# Altium schematic sheet Power_distribution2.SchDoc
size A4; SheetNumber: 2; SheetTotal: 2
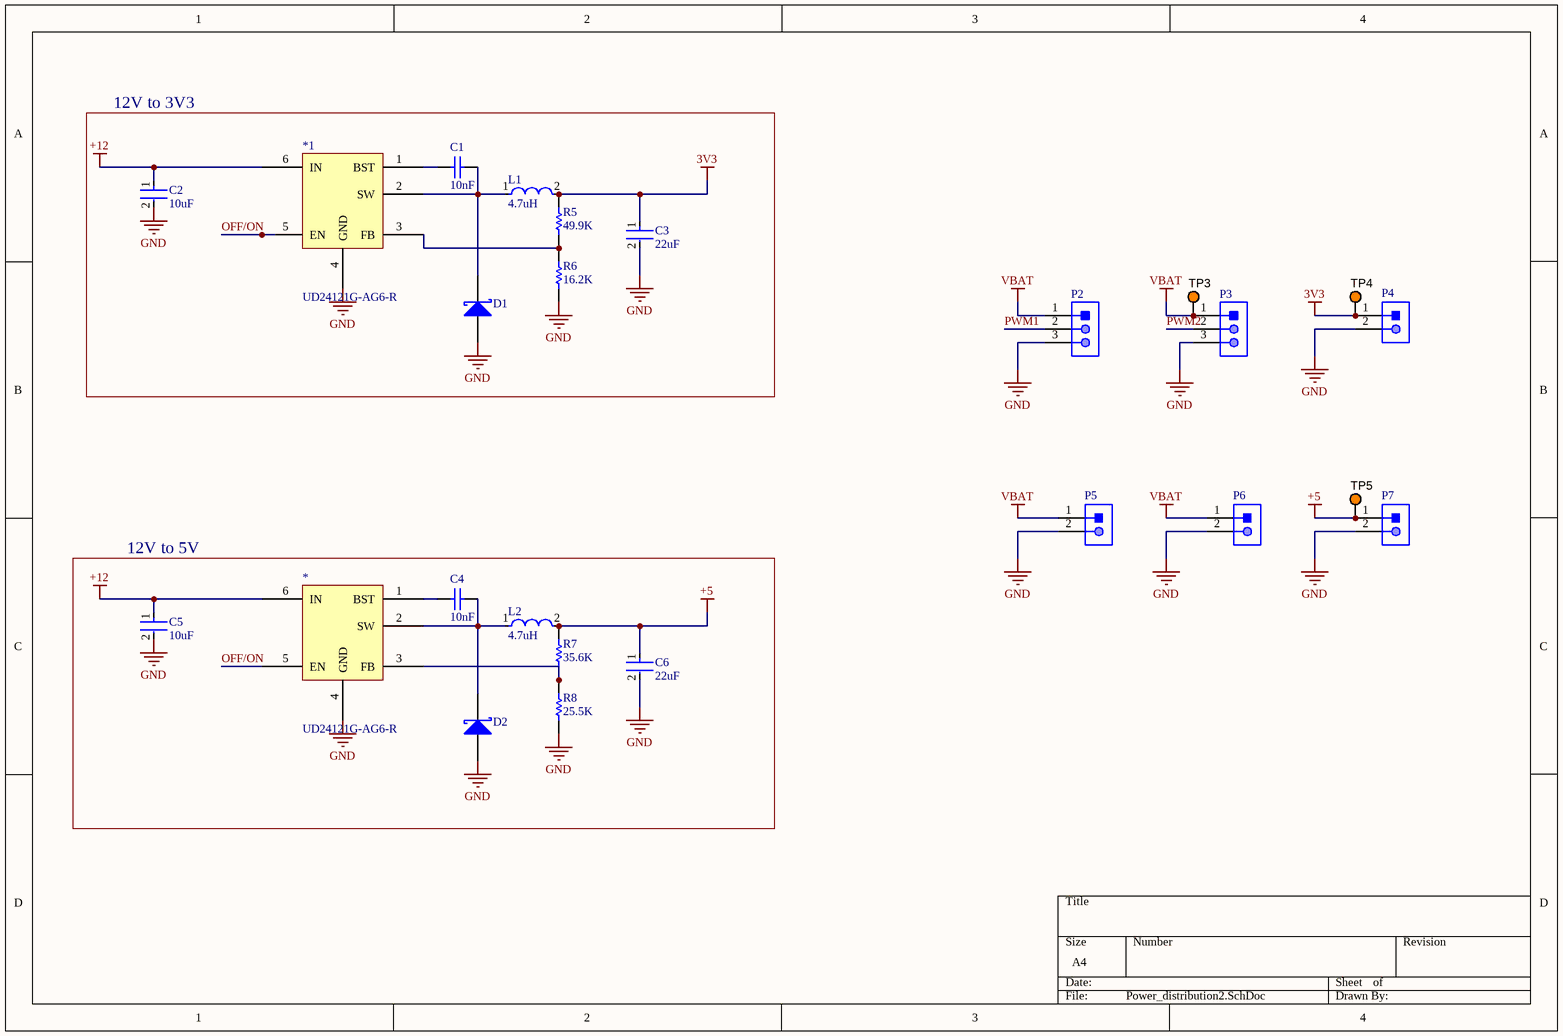
[diagram p0: Power_distribution2.SchDoc]

## Parts
*  UD24121G-AG6-R  [SOT95P245X110-6N]
*1  UD24121G-AG6-R  [SOT95P245X110-6N]
C1  10nF  [CAPC1608X90X35ML10T15]
C2  10uF  [FP-1210-L_3_3_0_4-W_2_5_0-MFG]
C3  22uF  [FP-GRM21B-0_15-MFG]
C4  10nF  [CAPC1608X90X35ML10T15]
C5  10uF  [FP-1210-L_3_3_0_4-W_2_5_0-MFG]
C6  22uF  [FP-GRM21B-0_15-MFG]
D1  B230A-13-F  [DIOD-SMA-2_V]  (value not drawn)
D2  B230A-13-F  [DIOD-SMA-2_V]  (value not drawn)
L1  4.7uH  [FP-LQH31CN_03-MFG]
L2  4.7uH  [FP-LQH31CN_03-MFG]
P2  B3B-PH-K-S(LF)(SN)  [JST-B3B-PH-K-S-3_V]  (value not drawn)
P3  B3B-PH-K-S(LF)(SN)  [JST-B3B-PH-K-S-3_V]  (value not drawn)
P4  S2B-PH-K-S(LF)(SN)  [JST-S2B-PH-K-S_V]  (value not drawn)
P5  S2B-PH-K-S(LF)(SN)  [JST-S2B-PH-K-S_V]  (value not drawn)
P6  S2B-PH-K-S(LF)(SN)  [JST-S2B-PH-K-S_V]  (value not drawn)
P7  S2B-PH-K-S(LF)(SN)  [JST-S2B-PH-K-S_V]  (value not drawn)
R5  49.9K  [RESC1005X40X25LL05T05]
R6  16.2K  [RESC2013X50X30NL20T20]
R7  35.6K  [RESC1005X40X25LL05T05]
R8  25.5K  [RESC2013X50X30NL20T20]
TP3  5003  [KSTN-5003]  (value not drawn)
TP4  5003  [KSTN-5003]  (value not drawn)
TP5  5003  [KSTN-5003]  (value not drawn)

## Blocks framed on the sheet
12V to 3V3: *1 C1-C3 D1 L1 R5 R6
12V to 5V: * C4-C6 D2 L2 R7 R8

## Nets
3V3: C3.1 L1.2 P4.1 R5.2 TP4.1
+5: C6.1 L2.2 P7.1 R7.2 TP5.1
+12: *.6(IN) *1.6(IN) C2.1 C5.1
GND: *.4(GND) *1.4(GND) C2.2 C3.2 C5.2 C6.2 D1.1(A) D2.1(A) P2.3 P3.3 P4.2 P5.2 P6.2 P7.2 R6.1 R8.1
VBAT: P2.1 P3.1 P5.1 P6.1 TP3.1
OFF/ON: *.5(EN) *1.5(EN)
PWM1: P2.2
PWM2: P3.2
Net*1_1: *1.1(BST) C1.1
Net*1_2: *1.2(SW) C1.2 D1.2(K) L1.1
Net*1_3: *1.3(FB) R5.1 R6.2
Net*_1: *.1(BST) C4.1
Net*_2: *.2(SW) C4.2 D2.2(K) L2.1
Net*_3: *.3(FB) R7.1 R8.2

## Library data of the parts
C1 C4 = CMP-2100-03642-1: Chip Capacitor, 10 nF, +/- 10%, 50 V, -55 to 125 degC, 0603 (1608 Metric), RoHS, Tape and Reel; Manufacturer: Murata; Insulation Resistance: 10GR; Dielectric: X7R; Voltage Rating: 50V; Material: Ceramic; Package Quantity: 1; Lead Free: LeadFree; Case/Package: 0603; Termination: SMD/SMT; REACH SVHC: Unknown; Manufacturer URL: http://www.murata.com/; Datasheet URL: http://search.murata.co.jp/Ceramy/image/img/A01X/G101/ENG/GRM188R71H103KA01-01.pdf; Mount: SurfaceMount; Datasheet Version: 42401.0; Number of Pins: 2; Length: 1.6mm; Voltage: 50V; Depth: 0.8mm; Tolerance: 10%; Min Operating Temperature: -55degC; Voltage Rating (DC): 50V; Max Operating Temperature: 125degC; Package Description: 2-Pin Surface Mount Device, Body 1.6 x 0.8 mm; RoHSCompliant: True; Case Code (Imperial): 0603; Width: 0.031inch; Case Code (Metric): 1608; Height: 0.8mm; Package Reference: 0603; Packaging: TapeandReel; Thickness: 0.035inch; Capacitance: 10nF; Dielectric Material: Ceramic
C2 C5 = CMP-2000-05477-2: General Purpose Ceramic Capacitor, 1210, 10uF, 10%, X5R, 15%, 25V; Lead Free: Lead Free; Max Operating Temperature: 85°C; REACH SVHC: No SVHC; Depth: 2.5mm; Packaging: Tape and Reel; Min Operating Temperature: -55°C; Height: 2.29mm; Construction: Flat; Case Code (Imperial): 1210; Radiation Hardening: No; Voltage: 25V; Case/Package: 1210; Series: -; Dielectric: X5R; Length: 3.2mm; Thickness: 0.11inch; Package Quantity: 1; Termination: SMD/SMT; Case Code (Metric): 3225; Voltage Rating (DC): 25V; Voltage Rating: 25V; Contact Plating: Tin; RoHS Compliant: Yes; Mount: Surface Mount; Width: 0.098inch; Capacitance: 10uF; Tolerance: 10%
C3 C6 = CMP-2007-03385-2: Chip Multilayer Ceramic Capacitors for General Purpose, 0805, 22uF, X5R, 15%, 20%, 6.3V; Material: Ceramic; Max Operating Temperature: 85°C; Voltage: 6.3V; Min Operating Temperature: -55°C; Case/Package: 0805; Thickness: 0.053inch; Dielectric: X5R; Packaging: Tape and Reel; Depth: 1.25mm; Termination: SMD/SMT; Voltage Rating (DC): 6.3V; Radiation Hardening: No; Tolerance: 20%; Mount: Surface Mount; Lead Free: Lead Free; Package Quantity: 1; REACH SVHC: No SVHC; Voltage Rating: 6.3V; Capacitance: 22uF; Length: 2mm; Case Code (Imperial): 0805; Case Code (Metric): 2012; Width: 0.049inch; Height: 1.25mm
D1 D2 = CMP-0905-00001-1: 2 A Surface Mount Schottky Barrier Rectifier, 30 V, -65 to 150 degC, 2-Pin SMA, RoHS, Tape and Reel; Manufacturer: Diodes Inc; VRRM: 30 V; IO: 2 A Max.; CT: 200 pF; IFSM: 50 A; VF: 0.5 V; IF: 2 A; ComponentLink1Description: Manufacturer URL; PackageDescription: 2-Pin SMA, Body 4.3 x 2.605 mm, Height 2.3 mm; Mounting Technology: Surface Mount; ComponentLink1URL: http://diodes.com/; VR: 30 V; PackageReference: SMA-2; RoHS: TRUE; ComponentLink2URL: http://diodes.com/datasheets/ds13004.pdf; Packing: Tape and Reel; DatasheetVersion: Rev. 21 - 2; ComponentLink2Description: Datasheet; Temperature Range: -65 to 150 degC; PartNumber: B230A-13-F
L1 L2 = CMP-06042-006664-1: Wire Wound Ferrite Inductor for General Circuits 4.7μH ±10% 2.21Ω 120mA 1206; Self Resonant Frequency: 31MHz; Current: 105mA; Test Frequency: 1MHz; Shielding: Unshielded; DC Resistance (DCR): 1.7R; Q Factor: 35; Length: 0.125inch; Package Quantity: 1; REACH SVHC: No SVHC; Weight: 0.001023oz; Inductance Tolerance: 10%; Case Code (Metric): 3216; Max Operating Temperature: 85°C; Case/Package: 1206; Inductance: 4.7uH; Radiation Hardening: No; Tolerance: 10%; Packaging: Tape and Reel; Military Standard: Not; Lead Free: Lead Free; Core Material: Ferrite; Min Operating Temperature: -25°C; Mount: Surface Mount; Current Rating: 120mA; Height: 1.8mm; Case Code (Imperial): 1206; Depth: 1.8mm; DC Current: 120mA; Max DC Current: 120mA; Width: 1.6mm; Termination: SMD/SMT
P2 P3 = CMP-2000-05164-1: Male Header, Pitch 2 mm, 1 x 3 Position, Height 6 mm, Tail Length 3.4 mm, -25 to 85 degC, RoHS, Bulk; Manufacturer: JST; Style/Orientation: StraightHeader/Plug; Pitch: 2mm; No of Positions: 3; Termination: Crimp; Manufacturer URL: http://www.jst.com/home2.html; Datasheet Version: Oct-06; Type: ShroudedHeader; Datasheet URL: https://datasheet.ciiva.com/11746/0900766b80826550-11746939.pdf
P4-P7 = CMP-1755-00004-1: Male Header, Pitch 2 mm, 1 x 2 Position, Height 4.8 mm, Tail Length 3.4 mm, -25 to 85 degC, RoHS, Bulk; Case\Package: Radial; Tolerance: 20%; Capacitance: 10 uF; Voltage Rating (DC): 50 V; Packaging: Bulk; ComponentLink1URL: http://www.jst-mfg.com/product/pdf/eng/ePH.pdf; Radiation Hardening: No; Height: 11 mm; Package Quantity: 200; PackageDescription: Male Header, Pitch 2 mm, 1 x 2 Position, Height 4.8 mm, Tail Length 3.4 mm; PackageReference: S2B-PH-K-S; Diameter: 5 mm; Pins: 2; Mount: Through Hole; Max Operating Temperature: 85 degC; Min Operating Temperature: -40 degC; ComponentLink1Description: Datasheet; DatasheetVersion: Dec-12; Length: 11 mm; Lead Pitch: 2 mm; REACH SVHC: No SVHC; Voltage Rating: 50 V; RoHSCompliant: true
R5 R7 = CMP-2002-00967-3: Chip Resistor, 49.9 KOhm, +/- 1%, 100 mW, -55 to 155 degC, 0402 (1005 Metric), RoHS, Tape and Reel; Manufacturer: Basic Passives; PartNumber: ERJ-2RKF4992X; Case\/Package: 0402; Power Rating: 100 mW; Voltage Rating: 50 V; Pins: 2; Case Code (Imperial): 0402; Package Quantity: 10000; REACH SVHC: No SVHC; DatasheetVersion: 04/2015; Width: 0.5 mm; Height: 0.35 mm; Case Code (Metric): 1005; ComponentLink2URL: http://industrial.panasonic.com/cdbs/www-data/pdf/RDA0000/AOA0000C86.pdf; Mounting Technology: Surface Mount; ComponentLink1Description: Manufacturer URL; Resistance: 49.9 KOhm; PackageDescription: 2-Pin Surface Mount Device, Body 1 x 0.5 mm; Radiation Hardening: No; RoHSCompliant: true; PackageReference: 0402; Max Operating Temperature: 155 degC; Packaging: Tape and Reel; Mount: Surface Mount; Tolerance: 1%; Min Operating Temperature: -55 degC; ComponentLink1URL: http://www.panasonic.com/; ComponentLink2Description: Datasheet; Length: 1 mm
R6 R8 = CMP-1013-00645-2: Part Number: CRCW080516K2FKEA; Manufacturer: Vishay Dale
TP3-TP5 = CMP-1672-00009-1: Test Point, Orange, 1-Pin THD, RoHS; Peak Reverse Current: 600 uA; Forward Current: 3 A; Max Surge Current: 80 A; Forward Voltage: 1.08 V; Max Operating Temperature: 150 degC; PackageReference: 5003; Pins: 2; ComponentLink2URL: http://keyelco.com/userAssets/file/M65p56.pdf; PackageDescription: 1-Pin Through Hole Device, Dia 2.54 mm; Weight: 0.01 lb; Diameter: 5.3 mm; Mount: Through Hole; Package Quantity: 500; Packaging: Bulk; Min Operating Temperature: -65 degC; ComponentLink1Description: Manufacturer URL; Height: 0.25 inch; ComponentLink1URL: http://www.keyelco.com/; ComponentLink2Description: Datasheet; Width: 0.25 inch; REACH SVHC: No SVHC; RoHSCompliant: true; Radiation Hardening: No; Length: 9.5 mm; DatasheetVersion: Jun-15